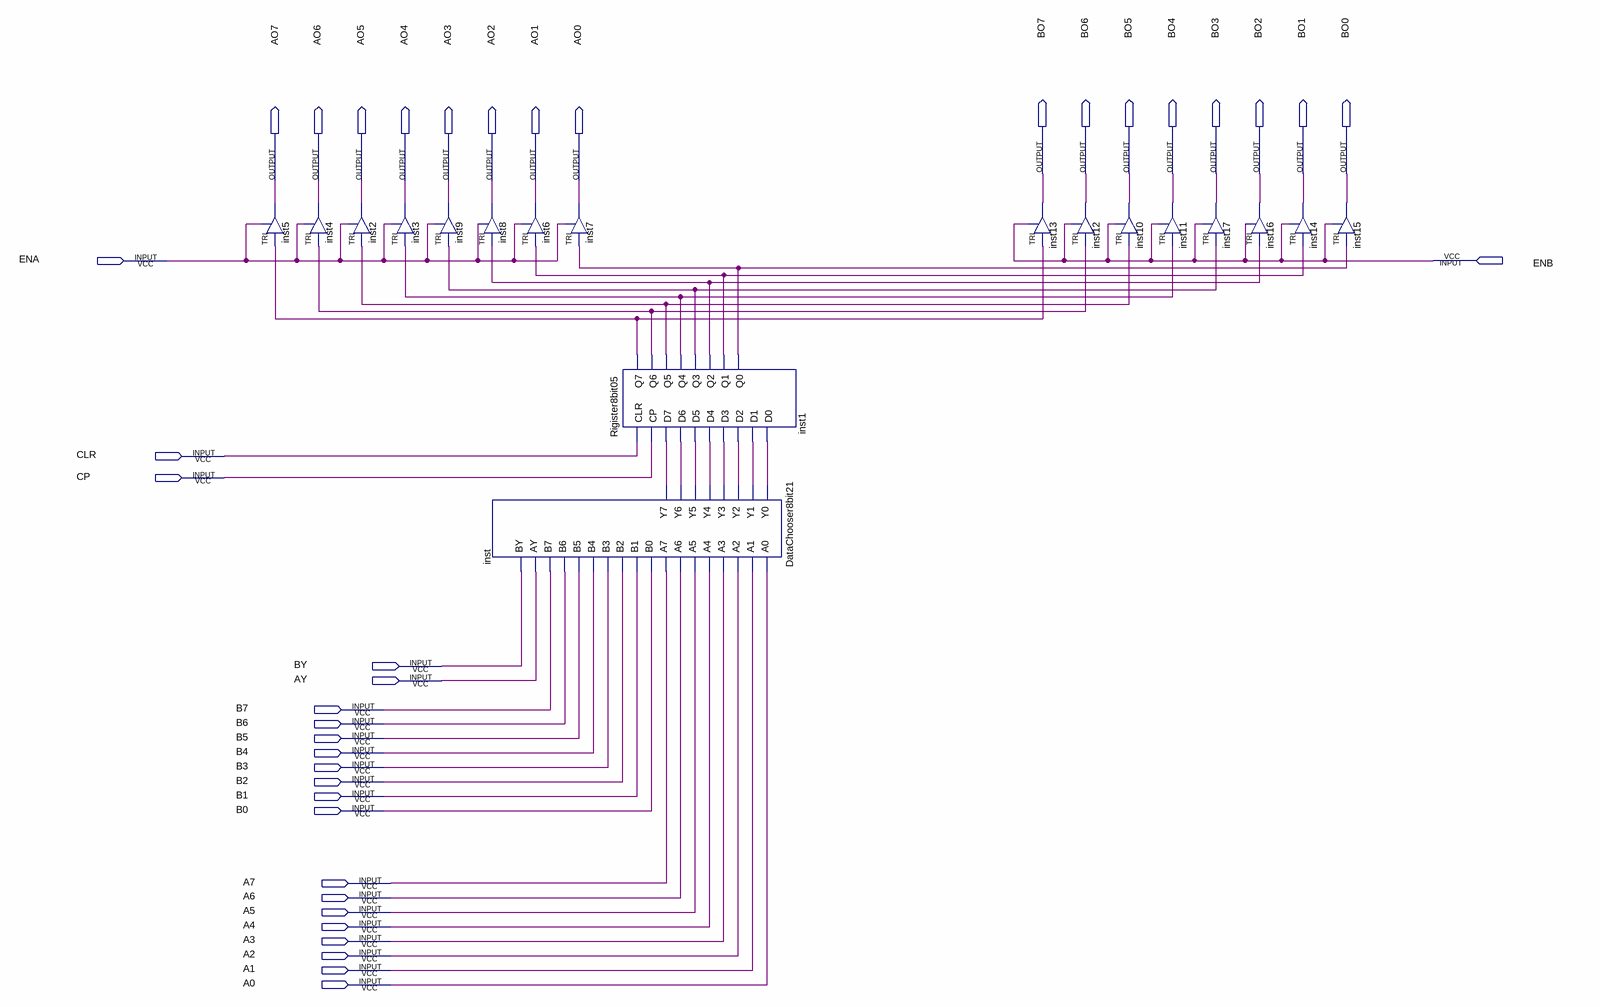
[diagram p0: schematic sheet]
// Quartus schematic MDR.bdf as structural Verilog: 18 symbols, 38 pins
module MDR (
  input  ENA,
  input  ENB,
  input  CLR,
  input  CP,
  input  BY,
  input  AY,
  input  B7,
  input  B6,
  input  B5,
  input  B4,
  input  B3,
  input  B2,
  input  B1,
  input  B0,
  input  A7,
  input  A6,
  input  A5,
  input  A4,
  input  A3,
  input  A2,
  input  A1,
  input  A0,
  output BO7,
  output BO6,
  output BO5,
  output BO4,
  output BO3,
  output BO2,
  output BO1,
  output BO0,
  output AO7,
  output AO6,
  output AO5,
  output AO4,
  output AO3,
  output AO2,
  output AO1,
  output AO0
);

  wire inst1_q0, inst1_q1, inst1_q2, inst1_q3, inst1_q4, inst1_q5, inst1_q6, inst1_q7, inst_y0, inst_y1,
       inst_y2, inst_y3, inst_y4, inst_y5, inst_y6, inst_y7;

  TRI inst5 (.IN(inst1_q7), .OE(ENA), .OUT(AO7));
  TRI inst2 (.IN(inst1_q5), .OE(ENA), .OUT(AO5));
  TRI inst4 (.IN(inst1_q6), .OE(ENA), .OUT(AO6));
  TRI inst3 (.IN(inst1_q4), .OE(ENA), .OUT(AO4));
  TRI inst9 (.IN(inst1_q3), .OE(ENA), .OUT(AO3));
  TRI inst6 (.IN(inst1_q1), .OE(ENA), .OUT(AO1));
  TRI inst8 (.IN(inst1_q2), .OE(ENA), .OUT(AO2));
  DataChooser8bit21 inst (
    .A0(A0), .A1(A1), .A2(A2), .A3(A3), .A4(A4), .A5(A5), .A6(A6), .A7(A7), .B0(B0), .B1(B1), .B2(B2),
    .B3(B3), .B4(B4), .B5(B5), .B6(B6), .B7(B7), .AY(AY), .BY(BY), .Y0(inst_y0), .Y1(inst_y1), .Y2(inst_y2),
    .Y3(inst_y3), .Y4(inst_y4), .Y5(inst_y5), .Y6(inst_y6), .Y7(inst_y7));
  TRI inst7 (.IN(inst1_q0), .OE(ENA), .OUT(AO0));
  Rigister8bit05 inst1 (
    .CLR(CLR), .CP(CP), .D7(inst_y7), .D6(inst_y6), .D5(inst_y5), .D4(inst_y4), .D3(inst_y3), .D2(inst_y2),
    .D1(inst_y1), .D0(inst_y0), .Q7(inst1_q7), .Q6(inst1_q6), .Q5(inst1_q5), .Q4(inst1_q4), .Q3(inst1_q3),
    .Q2(inst1_q2), .Q1(inst1_q1), .Q0(inst1_q0));
  TRI inst13 (.IN(inst1_q7), .OE(ENB), .OUT(BO7));
  TRI inst12 (.IN(inst1_q6), .OE(ENB), .OUT(BO6));
  TRI inst10 (.IN(inst1_q5), .OE(ENB), .OUT(BO5));
  TRI inst11 (.IN(inst1_q4), .OE(ENB), .OUT(BO4));
  TRI inst17 (.IN(inst1_q3), .OE(ENB), .OUT(BO3));
  TRI inst16 (.IN(inst1_q2), .OE(ENB), .OUT(BO2));
  TRI inst14 (.IN(inst1_q1), .OE(ENB), .OUT(BO1));
  TRI inst15 (.IN(inst1_q0), .OE(ENB), .OUT(BO0));
endmodule
